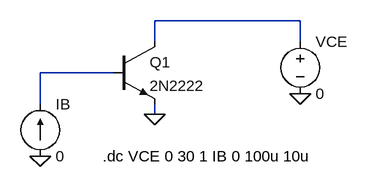
[diagram p0: schematic 001 TJB.asc]
001 TJB.asc, the LTspice schematic file:
Version 4
SHEET 1 880 680
WIRE 384 80 160 80
WIRE 160 112 160 80
WIRE 384 112 384 80
WIRE 96 160 -16 160
WIRE -16 208 -16 160
WIRE 160 224 160 208
FLAG -16 288 0
FLAG 160 224 0
FLAG 384 192 0
SYMBOL npn 96 112 R0
SYMATTR InstName Q1
SYMATTR Value 2N2222
SYMBOL voltage 384 96 R0
SYMATTR InstName VCE
SYMATTR Value 0
SYMBOL current -16 288 M180
WINDOW 0 24 80 Left 2
WINDOW 3 24 0 Left 2
SYMATTR InstName IB
SYMATTR Value 0
TEXT 80 288 Left 2 !.dc VCE 0 30 1 IB 0 100u 10u

The netlist it stands for:
* 001 TJB.asc
Q1 N001 N002 0 0 2N2222
VCE N001 0 0
IB 0 N002 0
.model NPN NPN
.model PNP PNP
.lib standard.bjt
.dc VCE 0 30 1 IB 0 100u 10u
.backanno
.end